# Altium project ANE_0002_01AA.PrjPCB (part 3 of 4)

## Sheet Boost_Converter.SchDoc
size A3; DocumentNumber: 8; SheetNumber: 8; SheetTotal: 11
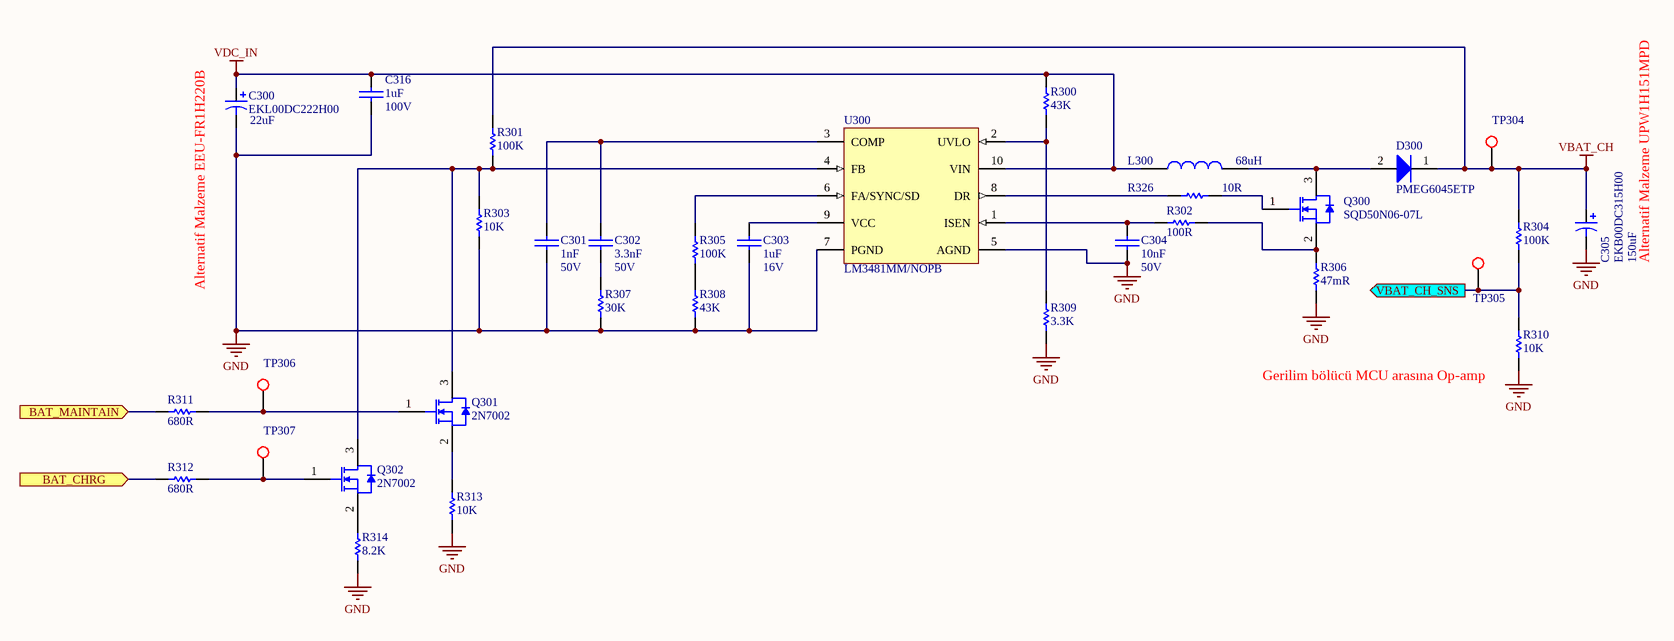
[diagram p7: Boost_Converter.SchDoc]

### Parts
C300  EKL00DC222H00  value 22uF  [CAPPR5-10X12.5]
C301  Operating Voltage: 50V  [CAPC1005X06N]  (hidden comment: 1nF)
C302  Operating Voltage: 50V  [CAPC1005X06N]  (hidden comment: 3.3nF)
C303  Operating Voltage: 16V  [CAPC2012X14N]  (hidden comment: 1uF)
C304  Operating Voltage: 50V  [CAPC1005X06N]  (hidden comment: 10nF)
C305  EKB00DC315H00  value 150uF  [CAPPR5-10X12.5]
C316  Operating Voltage: 100V  [CAPC3216X09N]  (hidden comment: 1uF)
D300  PMEG6045ETP  [DIOM3825X11N]
L300  68uH  [INDM120120X100N]
Q300  SQD50N06-07L  [TO228P970-3N]
Q301  2N7002  [SOT90P247X115-3N]
Q302  2N7002  [SOT90P247X115-3N]
R300  43K  [RESC1005X04N]
R301  100K  [RESC1005X04N]
R302  100R  [RESC1005X04N]
R303  10K  [RESC1005X04N]
R304  100K  [RESC1005X04N]
R305  100K  [RESC1005X04N]
R306  47mR  [RESC3216X08N]
R307  30K  [RESC1005X04N]
R308  43K  [RESC1005X04N]
R309  3.3K  [RESC1005X04N]
R310  10K  [RESC1005X04N]
R311  680R  [RESC1005X04N]
R312  680R  [RESC1005X04N]
R313  10K  [RESC1005X04N]
R314  8.2K  [RESC1005X04N]
R326  10R  [RESC1005X04N]
TP304  AEMT-C00S-1000-0000  [TP100]  (value not drawn)
TP305  AEMT-C00S-1000-0000  [TP100]  (value not drawn)
TP306  AEMT-C00S-1000-0000  [TP100]  (value not drawn)
TP307  AEMT-C00S-1000-0000  [TP100]  (value not drawn)
U300  LM3481MM/NOPB  [MUB10A_N]

### Ports
BAT_CHRG (in), BAT_MAINTAIN (in), VBAT_CH_SNS (out)

### Nets
GND: C300.2 C301.1 C303.1 C304.1 C305.2 C316.1 R303.1 R306.2 R307.1 R308.1 R309.1 R310.1 R313.1 R314.1 U300.5(AGND) U300.7(PGND)
VBAT_CH: C305.1 D300.1(K) R301.2 R304.2 TP304.1
VDC_IN: C300.1 C316.2 L300.1 R300.2 U300.10(VIN)
BAT_CHRG: R312.2 ; port BAT_CHRG
BAT_MAINTAIN: R311.2 ; port BAT_MAINTAIN
VBAT_CH_SNS: R304.1 R310.2 TP305.1 ; port VBAT_CH_SNS
NetC301_2: C301.2 C302.2 U300.3(COMP)
NetC302_1: C302.1 R307.2
NetC303_2: C303.2 U300.9(VCC)
NetC304_2: C304.2 R302.1 U300.1(ISEN)
NetD300_2: D300.2(A) L300.2 Q300.3(Drain)
NetQ300_1: Q300.1(Gate) R326.2
NetQ300_2: Q300.2(Source) R302.2 R306.1
NetQ301_1: Q301.1(Gate) R311.1 TP306.1
NetQ301_2: Q301.2(Source) R313.2
NetQ301_3: Q301.3(Drain) Q302.3(Drain) R301.1 R303.2 U300.4(FB)
NetQ302_1: Q302.1(Gate) R312.1 TP307.1
NetQ302_2: Q302.2(Source) R314.2
NetR300_1: R300.1 R309.2 U300.2(UVLO)
NetR305_1: R305.1 R308.2
NetR305_2: R305.2 U300.6(FA/SYNC/SD)
NetR326_1: R326.1 U300.8(DR)

### Notes on the sheet
- (near C300) Alternatif Malzeme EEU-FR1H220B
- (near C305) Alternatif Malzeme UPW1H151MPD
- (near R310) Gerilim bölücü MCU arasına Op-amp
- Title
- Size:
- Date:
- A3
- Number:
- Time:
- Revision:
- Sheet
- of
- File:

### Library data of the parts
C300 = EKL00DC222H00: Aluminum Electrolytic Capacitor, Radial Style with Long Leads: 22uF, 50V; Note: Refer to Manufacturer's Data Sheets for other lead formations; DrillSize: Nominal, Rounded To The Nearest 0.1mm; Published: 19-Mar-2004; DatasheetDocument: 12-Jan-2000; PackageReference: CAPPR5-10X12.5; Publisher: Altium Limited; ComponentLink1Description: Manufacturer Link; ComponentLink1URL: http://www.vishay.com/; ComponentLink2Description: Datasheet; ComponentLink2URL: http://www.vishay.com/docs/25010/ekl.pdf
C301 = ACC0-0100-S272-0000: CAP, CER, C0G, 1nF, %5, 50V, 0402; Manufacturer: Murata; Manufacturer Part Number: GRM1555C1H102JA01D; CR: 000049; Requested by: MU; Lead Finish: Pb Free; Material: Ceramic, C0G; Definition Date: 14.08.2012; Revision Date: *; Price: *; Supplier: *; Supplier Part Number: *; DS: 000049; Operating Temp: -55 to 125 C; Storage Temp: -55 to 125 C; Status: Active; Package Reference: EIA 0402, Metric 1005; Component Type: Capacitor; Footprint Type: SMD; Published by: MU; ESR: *; FR: *; Value: 1nF
C302 = ACC7-0330-S271-0000: CAP, CER, X7R, 3.3nF, %10, 50V, 0402; Manufacturer: Murata; Manufacturer Part Number: GRM155R71H332KA01D; CR: 000049; Requested by: MU; Lead Finish: Pb Free; Material: Ceramic, X7R; Definition Date: 14.08.2012; Revision Date: *; Price: *; Supplier: *; Supplier Part Number: *; DS: 000049; Operating Temp: -55 to 125 C; Storage Temp: -55 to 125 C; Status: Active; Package Reference: EIA 0402, Metric 1005; Component Type: Capacitor; Footprint Type: SMD; Published by: MU; ESR: *; FR: *; Value: 3.3nF
C303 = ACC7-3100-S441-0000: CAP, CER, X7R, 1uF, %10, 16V, 0805; Manufacturer: Murata; Manufacturer Part Number: GRM21BR71C105KA01L; CR: 000049; Requested by: MU; Lead Finish: Pb Free; Material: Ceramic, X7R; Definition Date: 14.08.2012; Revision Date: *; Price: *; Supplier: *; Supplier Part Number: *; DS: 000049; Operating Temp: -55 to 125 C; Storage Temp: -55 to 125 C; Status: Active; Package Reference: EIA 0805, Metric 2012; Component Type: Capacitor; Footprint Type: SMD; Published by: MU; ESR: *; FR: *; Value: 1uF
C304 = ACC7-1100-S271-0000: CAP, CER, X7R, 10nF, %10, 50V, 0402; Manufacturer: Murata; Manufacturer Part Number: GRM155R71H103KA88D; CR: 000049; Requested by: MU; Lead Finish: Pb Free; Material: Ceramic, X7R; Definition Date: 14.08.2012; Revision Date: *; Price: *; Supplier: *; Supplier Part Number: *; DS: 000049; Operating Temp: -55 to 125 C; Storage Temp: -55 to 125 C; Status: Active; Package Reference: EIA 0402, Metric 1005; Component Type: Capacitor; Footprint Type: SMD; Published by: MU; ESR: *; FR: *; Value: 10nF
C305 = EKB00DC315H00: Aluminum Electrolytic Capacitor, Radial Style with Long Leads: 150uF, 50V; Note: Refer to Manufacturer's Data Sheets for other lead formations; DrillSize: Nominal, Rounded To The Nearest 0.1mm; Published: 19-Mar-2004; DatasheetDocument: 21-Feb-2001; PackageReference: CAPPR5-10X12.5; Publisher: Altium Limited; ComponentLink1Description: Manufacturer Link; ComponentLink1URL: http://www.vishay.com/; ComponentLink2Description: Datasheet; ComponentLink2URL: http://www.vishay.com/docs/25013/ekb.pdf
C316 = ACC7-3100-S691-0000: CAP, CER, X7R, 1uF, %10, 100V, 1206; Manufacturer: Murata; Manufacturer Part Number: GRM31CR72A105KA01L; CR: 344; Requested by: NK; DS: 00049; Lead Finish: Pb Free; Published by: IS; Material: Ceramic, X7R; Definition Date: 13.02.2014; Revision Date: *; Price: *; Supplier: *; Supplier Part Number: *; Operating Temp: -55 to 125 C; Storage Temp: -55 to 125 C; Status: Active; Package Reference: EIA 1206, Metric 3216; Component Type: Capacitor; Footprint Type: SMD; ESR: *; FR: *; Value: 1uF
D300 = AS15-945M-SI10-0000: Diode, Schottky, 0.53V @4.5A, 60V, SOD-128; Manufacturer: NXP; Lead Finish: Pb Free; Published by: NK; Price: *; Manufacturer Part Number: PMEG6045ETP; CR: -; DS: -; Definition Date: 25.07.2015; Footprint Type: SMD; JEDEC Code: *; Operating Temp: -55 to 175 C; Package Reference: SOD128; Requested by: NK; Revision Date: *; Status: Active; Storage Temp: -65to 175 C; Supplier: *; Supplier Part Number: *; Component Type: DIODE; Forward Voltage: *; Reverse Voltage: *; Value: *
L300 = AL17-1680-SN35-3300: Inductor, Power, 68uH, 3A, 0.1ohm, SMD; Manufacturer: Bourns; Manufacturer Part Number: SRR1210-680M; DCR(max): 0.102; Published By: NK; CR: -; DS: -; Component Type: Power Inductor; Definition Date: 26.07.2015; Footprint Type: SMD; Height: 10; Operating Temp: -40, +125; Rated Current: 3A; Requested By: NK; Value: 68uH
Q300 = AS26-A50M-SI40-0000: Transistor, MOSFET, N, 60V, 50A, 7.6mR, SQD50N06-07L, TO-252; Manufacturer Part Number: SQD50N06-07L-GE3; Manufacturer: VISHAY; CR: 000207/85; DS: 000207; Lead Finish: Pb Free; Published by: MU; Requested by: MAY; Vgs(max): +-20V; Price: *; Definition Date: 18.02.2013; Footprint Type: SMD; JEDEC Code: TO-252; Operating Temp: -55 to 175 C; Package Reference: TO-252; Revision Date: *; Status: Active; Storage Temp: -55 to 175 C; Supplier: *; Supplier Part Number: *; Component Type: TRS/MOSFET; Vds(max): 60V; Id: 50A; Value: SQD50N06-07L
Q301 Q302 = AS26-810M-SI20-0000: Transistor, MOSFET, N, 60V, 115mA, 2N7002, SOT23; Manufacturer: Fairchild; CR: 000338; DS: 000368; JEDEC Code: TO-236AB; Lead Finish: Pb Free; Published by: MU; Requested by: MAY; Vgs(max): +-20V; Price: *; Manufacturer Part Number: 2N7002; Definition Date: 27.01.2014; Footprint Type: SMD; Operating Temp: -55 to 150 C; Package Reference: SOT23; Revision Date: *; Status: Active; Storage Temp: -55 to 150 C; Supplier: *; Supplier Part Number: *; Component Type: TRS/MOSFET; Vds(max): 60V; Id: 115mA; Value: 2N7002
R300 R308 = AR19-4430-S2B2-0000: RES, E24, Thick Film, SMD, 43K, 1%, 0.1W, 0402; Manufacturer: Panasonic; Manufacturer Part Number: ERJ-2RKF4302X; CR: DS00073; Requested by: MU; Lead Finish: Pb Free; Max. Operating Voltage: 50V; Definition Date: 16.08.2012; Revision Date: *; Price: *; Supplier: *; Supplier Part Number: *; DS: DS00073; Operating Temp: -55 to 155 C; Storage Temp: -55 to 155 C; Status: Active; Package Reference: EIA 0402, Metric 1005; Component Type: Resistor; Footprint Type: SMD; Published by: MU; JEDEC Code: *; Material: Thick Film; ESR: *; FR: *; Power Rating: 0.1W; Value: 43K
R301 R304 R305 = AR19-5100-S2B2-0000: RES, E24, Thick Film, SMD, 100K, 1%, 0.1W, 0402; Manufacturer: Panasonic; Manufacturer Part Number: ERJ-2RKF1003X; CR: DS00073; Requested by: MU; Lead Finish: Pb Free; Max. Operating Voltage: 50V; Definition Date: 16.08.2012; Revision Date: *; Price: *; Supplier: *; Supplier Part Number: *; DS: DS00073; Operating Temp: -55 to 155 C; Storage Temp: -55 to 155 C; Status: Active; Package Reference: EIA 0402, Metric 1005; Component Type: Resistor; Footprint Type: SMD; Published by: MU; JEDEC Code: *; Material: Thick Film; ESR: *; FR: *; Power Rating: 0.1W; Value: 100K
R302 = AR19-2100-S2B2-0000: RES, E24, Thick Film, SMD, 100R, 1%, 0.1W, 0402; Manufacturer: Panasonic; Manufacturer Part Number: ERJ-2RKF1000X; CR: DS00073; Requested by: MU; Lead Finish: Pb Free; Max. Operating Voltage: 50V; Definition Date: 16.08.2012; Revision Date: *; Price: *; Supplier: *; Supplier Part Number: *; DS: DS00073; Operating Temp: -55 to 155 C; Storage Temp: -55 to 155 C; Status: Active; Package Reference: EIA 0402, Metric 1005; Component Type: Resistor; Footprint Type: SMD; Published by: MU; JEDEC Code: *; Material: Thick Film; ESR: *; FR: *; Power Rating: 0.1W; Value: 100R
R303 R310 R313 = AR19-4100-S2B2-0000: RES, E24, Thick Film, SMD, 10K, 1%, 0.1W, 0402; Manufacturer: Panasonic; Manufacturer Part Number: ERJ-2RKF1002X; CR: DS00073; Requested by: MU; Lead Finish: Pb Free; Max. Operating Voltage: 50V; Definition Date: 16.08.2012; Revision Date: *; Price: *; Supplier: *; Supplier Part Number: *; DS: DS00073; Operating Temp: -55 to 155 C; Storage Temp: -55 to 155 C; Status: Active; Package Reference: EIA 0402, Metric 1005; Component Type: Resistor; Footprint Type: SMD; Published by: MU; JEDEC Code: *; Material: Thick Film; ESR: *; FR: *; Power Rating: 0.1W; Value: 10K
R306 = AR19-Y470-S5D2-0000: RES, Thick Film, SMD, 47mR, 1%, 1W, 1206; Manufacturer: Panasonic; Manufacturer Part Number: ERJ-8BWFR047V; CR: 000078/95; Requested by: MU; DS: 000078; Lead Finish: Pb Free; Max. Operating Voltage: 0.40; Definition Date: 19.02.2013; Revision Date: *; Price: *; Supplier: *; Supplier Part Number: *; Operating Temp: -55 to 155 C; Storage Temp: -55 to 155 C; Status: Active; Package Reference: EIA 1206, Metric 3216; Component Type: Resistor; Footprint Type: SMD; Published by: MU; JEDEC Code: *; Material: Thick Film; ESR: *; FR: *; Power Rating: 1W; Value: 47mR
R307 = AR19-4300-S2B2-0000: RES, E24, Thick Film, SMD, 30K, 1%, 0.1W, 0402; Manufacturer: Panasonic; Manufacturer Part Number: ERJ-2RKF3002X; CR: DS00073; Requested by: MU; Lead Finish: Pb Free; Max. Operating Voltage: 50V; Definition Date: 16.08.2012; Revision Date: *; Price: *; Supplier: *; Supplier Part Number: *; DS: DS00073; Operating Temp: -55 to 155 C; Storage Temp: -55 to 155 C; Status: Active; Package Reference: EIA 0402, Metric 1005; Component Type: Resistor; Footprint Type: SMD; Published by: MU; JEDEC Code: *; Material: Thick Film; ESR: *; FR: *; Power Rating: 0.1W; Value: 30K
R309 = AR19-3330-S2B2-0000: RES, E24, Thick Film, SMD, 3.3K, 1%, 0.1W, 0402; Manufacturer: Panasonic; Manufacturer Part Number: ERJ-2RKF3301X; CR: DS00073; Requested by: MU; Lead Finish: Pb Free; Max. Operating Voltage: 50V; Definition Date: 16.08.2012; Revision Date: *; Price: *; Supplier: *; Supplier Part Number: *; DS: DS00073; Operating Temp: -55 to 155 C; Storage Temp: -55 to 155 C; Status: Active; Package Reference: EIA 0402, Metric 1005; Component Type: Resistor; Footprint Type: SMD; Published by: MU; JEDEC Code: *; Material: Thick Film; ESR: *; FR: *; Power Rating: 0.1W; Value: 3.3K
R311 R312 = AR19-2680-S2B2-0000: RES, E24, Thick Film, SMD, 680R, 1%, 0.1W, 0402; Manufacturer: Panasonic; Manufacturer Part Number: ERJ-2RKF6800X; CR: DS00073; Requested by: MU; Lead Finish: Pb Free; Max. Operating Voltage: 50V; Definition Date: 16.08.2012; Revision Date: *; Price: *; Supplier: *; Supplier Part Number: *; DS: DS00073; Operating Temp: -55 to 155 C; Storage Temp: -55 to 155 C; Status: Active; Package Reference: EIA 0402, Metric 1005; Component Type: Resistor; Footprint Type: SMD; Published by: MU; JEDEC Code: *; Material: Thick Film; ESR: *; FR: *; Power Rating: 0.1W; Value: 680R
R314 = AR19-3820-S2B2-0000: RES, E24, Thick Film, SMD, 8.2K, 1%, 0.1W, 0402; Manufacturer: Panasonic; Manufacturer Part Number: ERJ-2RKF8201X; CR: DS00073; Requested by: MU; Lead Finish: Pb Free; Max. Operating Voltage: 50V; Definition Date: 16.08.2012; Revision Date: *; Price: *; Supplier: *; Supplier Part Number: *; DS: DS00073; Operating Temp: -55 to 155 C; Storage Temp: -55 to 155 C; Status: Active; Package Reference: EIA 0402, Metric 1005; Component Type: Resistor; Footprint Type: SMD; Published by: MU; JEDEC Code: *; Material: Thick Film; ESR: *; FR: *; Power Rating: 0.1W; Value: 8.2K
R326 = AR19-1100-S2B2-0000: RES, E24, Thick Film, SMD, 10R, 1%, 0.1W, 0402; Manufacturer: Panasonic; Manufacturer Part Number: ERJ-2RKF10R0X; CR: DS00073; Requested by: MU; Lead Finish: Pb Free; Max. Operating Voltage: 50V; Definition Date: 16.08.2012; Revision Date: *; Price: *; Supplier: *; Supplier Part Number: *; DS: DS00073; Operating Temp: -55 to 155 C; Storage Temp: -55 to 155 C; Status: Active; Package Reference: EIA 0402, Metric 1005; Component Type: Resistor; Footprint Type: SMD; Published by: MU; JEDEC Code: *; Material: Thick Film; ESR: *; FR: *; Power Rating: 0.1W; Value: 10R
TP304-TP307 = AEMT-C00S-1000-0000: Test Point, Circular, 1mm; Text: TEST_POINT
U300 = LM3481MM/NOPB: High Efficiency Low-Side N-Channel Controller for Switching Regulators, 10-pin MSOP, Pb-Free; Manufacturer: National Semiconductor; PackageTopMarking: ZXTT*SJPB; PowerWise: N; CompType: MiscPower; High-Reliability: Y; DatasheetVersion: Mar-2011; PackageVersion: revB, Jul-2003; PackageReference: MUB10A; PackageDescription: Mini-SO, Molded, .118 x .118 x .034in Body, 10 Lead, .0197in Pitch; PartNumber: LM3481MM/NOPB; RoHS: Y; PinCount: 10; Code_JEDEC: MO-187-BA; ComponentLink1Description: Manufacturer URL; ComponentLink1URL: http://www.national.com/; ComponentLink2Description: LM3481 Datasheet; ComponentLink2URL: http://www.national.com/ds/LM/LM3481.pdf; ComponentLink3Description: LM3481 Web Page; ComponentLink3URL: http://www.national.com/pf/LM/LM3481.html; ComponentLink4Description: MUB10A Package Page; ComponentLink4URL: http://www.national.com/packaging/folders/mub10a.html

## Sheet Buck_Converter.SchDoc
size A3; DocumentNumber: 10; SheetNumber: 10; SheetTotal: 11
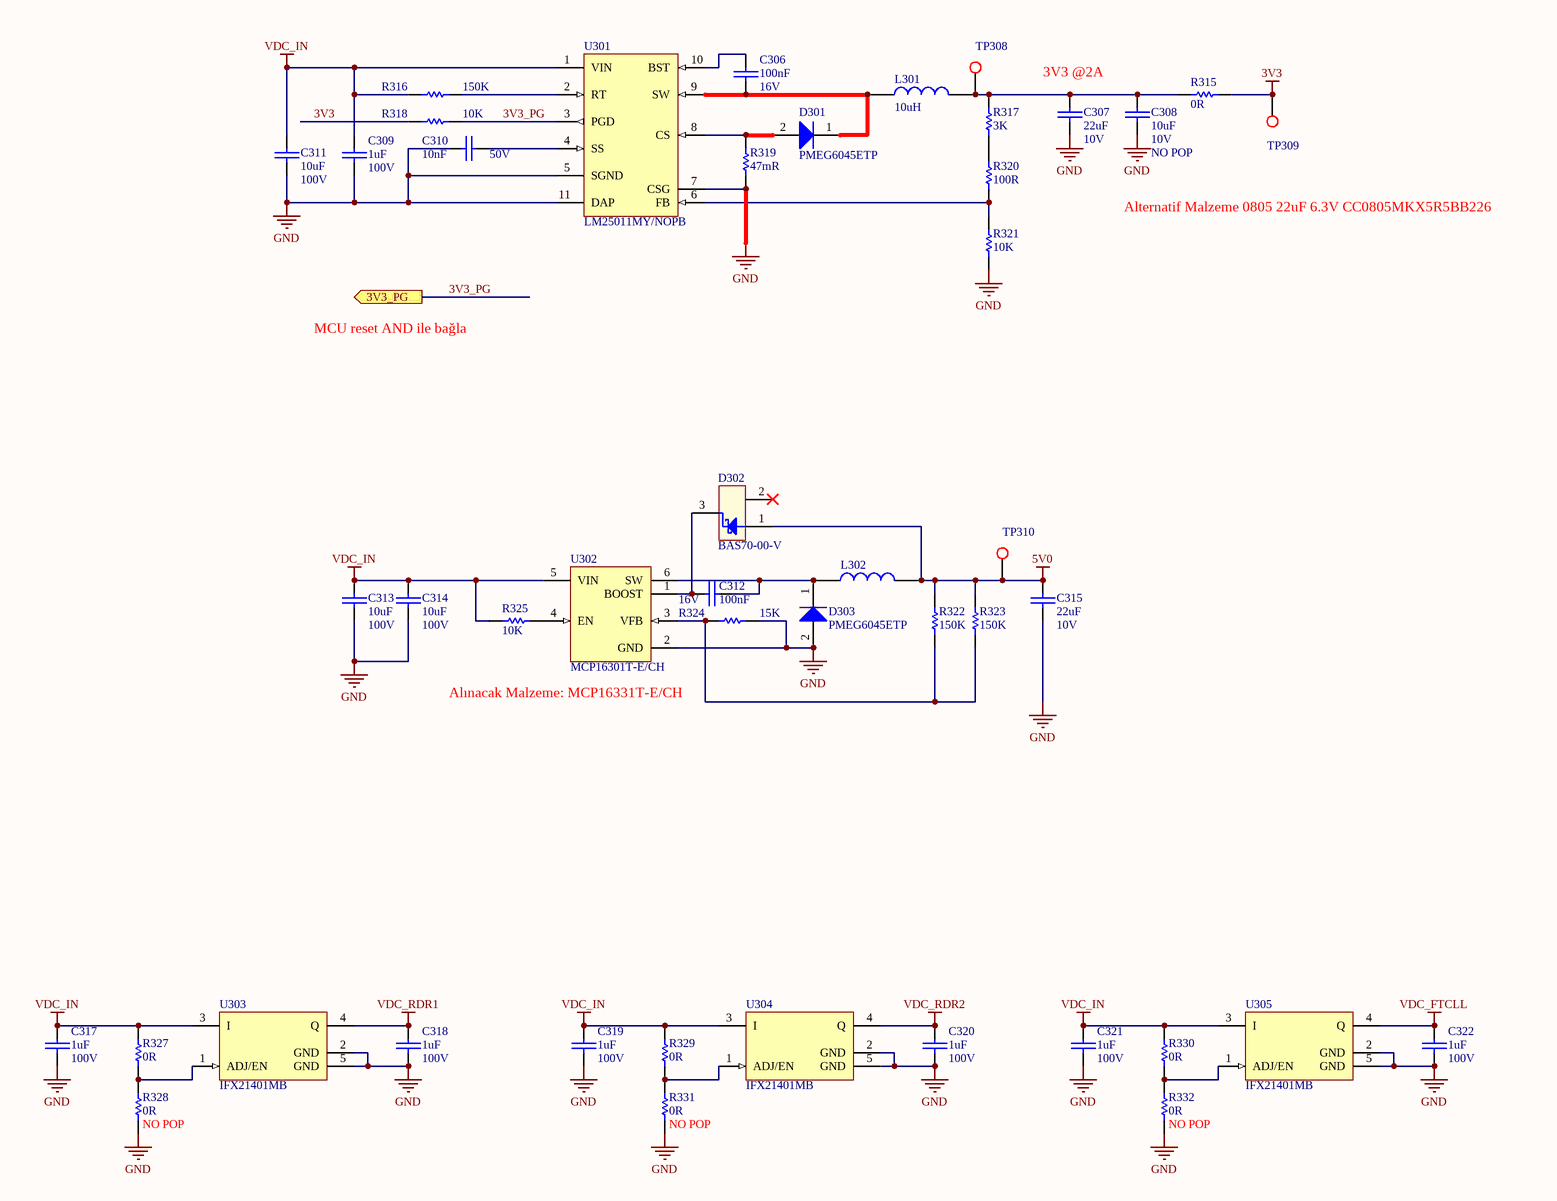
[diagram p8: Buck_Converter.SchDoc]

### Parts
C306  Operating Voltage: 16V  [CAPC1005X06N]  (hidden comment: 100nF)
C307  Operating Voltage: 10V  [CAPC3225X27N]  (hidden comment: 22uF)
C308  Operating Voltage: 10V  Assembly: NO POP  [CAPC2012X09N]  (hidden comment: 10uF)
C309  Operating Voltage: 100V  [CAPC3216X09N]  (hidden comment: 1uF)
C310  Operating Voltage: 50V  [CAPC1005X06N]  (hidden comment: 10nF)
C311  Operating Voltage: 100V  [CAPC5750X25N]  (hidden comment: 10uF)
C312  Operating Voltage: 16V  [CAPC1005X06N]  (hidden comment: 100nF)
C313  Operating Voltage: 100V  [CAPC5750X25N]  (hidden comment: 10uF)
C314  Operating Voltage: 100V  [CAPC5750X25N]  (hidden comment: 10uF)
C315  Operating Voltage: 10V  [CAPC3225X27N]  (hidden comment: 22uF)
C317  Operating Voltage: 100V  [CAPC3216X09N]  (hidden comment: 1uF)
C318  Operating Voltage: 100V  [CAPC3216X09N]  (hidden comment: 1uF)
C319  Operating Voltage: 100V  [CAPC3216X09N]  (hidden comment: 1uF)
C320  Operating Voltage: 100V  [CAPC3216X09N]  (hidden comment: 1uF)
C321  Operating Voltage: 100V  [CAPC3216X09N]  (hidden comment: 1uF)
C322  Operating Voltage: 100V  [CAPC3216X09N]  (hidden comment: 1uF)
D301  PMEG6045ETP  [DIOM3825X11N]
D302  BAS70-00-V  [SOT90P247X115-3N]
D303  PMEG6045ETP  [DIOM3825X11N]
L301  10uH  [INDM125125X65N]
L302  (no value)  [INDM125125X65N]
R315  0R  [RESC2012X07N]
R316  150K  [RESC1005X04N]
R317  3K  [RESC1005X04N]
R318  10K  [RESC1005X04N]
R319  47mR  [RESC3216X08N]
R320  100R  [RESC1005X04N]
R321  10K  [RESC1005X04N]
R322  150K  [RESC1005X04N]
R323  150K  [RESC1005X04N]
R324  15K  [RESC1005X04N]
R325  10K  [RESC1005X04N]
R327  0R  [RESC1005X04N]
R328  Assembly: NO POP  [RESC1005X04N]  (hidden comment: 0R)
R329  0R  [RESC1005X04N]
R330  0R  [RESC1005X04N]
R331  Assembly: NO POP  [RESC1005X04N]  (hidden comment: 0R)
R332  Assembly: NO POP  [RESC1005X04N]  (hidden comment: 0R)
TP308  AEMT-C00S-1000-0000  [TP100]  (value not drawn)
TP309  AEMT-C00S-1000-0000  [TP100]  (value not drawn)
TP310  AEMT-C00S-1000-0000  [TP100]  (value not drawn)
U301  LM25011MY/NOPB  [MUC10A_N]
U302  MCP16301T-E/CH  [MCHP-SOT-23-CH6_N]
U303  IFX21401MB  [INF-PG-SCT595_V]
U304  IFX21401MB  [INF-PG-SCT595_V]
U305  IFX21401MB  [INF-PG-SCT595_V]

### Ports
3V3_PG (out)

### Nets
3V3: R315.2 R318.2 TP309.1
5V0: C315.2 D302.1 L302.2 R322.2 R323.2 TP310.1
GND: C307.1 C308.1 C309.1 C310.1 C311.1 C313.1 C314.1 C315.1 C317.1 C318.1 C319.1 C320.1 C321.1 C322.1 D303.2(A) R319.2 R321.1 R324.1 R328.1 R331.1 R332.1 U301.5(SGND) U301.7(CSG) U301.11(DAP) U302.2(GND) U303.2(GND) U303.5(GND) U304.2(GND) U304.5(GND) U305.2(GND) U305.5(GND)
VDC_FTCLL: C322.2 U305.4(Q)
VDC_IN: C309.2 C311.2 C313.2 C314.2 C317.2 C319.2 C321.2 R316.2 R325.1 R327.2 R329.2 R330.2 U301.1(VIN) U302.5(VIN) U303.3(I) U304.3(I) U305.3(I)
VDC_RDR1: C318.2 U303.4(Q)
VDC_RDR2: C320.2 U304.4(Q)
3V3_PG: R318.1 U301.3(PGD) ; port 3V3_PG
NetC306_1: C306.1 D301.1(K) L301.1 U301.9(SW)
NetC306_2: C306.2 U301.10(BST)
NetC307_2: C307.2 C308.2 L301.2 R315.1 R317.2 TP308.1
NetC310_2: C310.2 U301.4(SS)
NetC312_1: C312.1 D303.1(K) L302.1 U302.6(SW)
NetC312_2: C312.2 D302.3 U302.1(BOOST)
NetD301_2: D301.2(A) R319.1 U301.8(CS)
NetR316_1: R316.1 U301.2(RT)
NetR317_1: R317.1 R320.1
NetR320_2: R320.2 R321.2 U301.6(FB)
NetR322_1: R322.1 R323.1 R324.2 U302.3(VFB)
NetR325_2: R325.2 U302.4(EN)
NetR327_1: R327.1 R328.2 U303.1(ADJ/EN)
NetR329_1: R329.1 R331.2 U304.1(ADJ/EN)
NetR330_1: R330.1 R332.2 U305.1(ADJ/EN)

Not connected (* = marked no-connect by the designer): D302 2(NC)*

### Notes on the sheet
- (near C307) 3V3 @2A
- Alternatif Malzeme 0805 22uF 6.3V CC0805MKX5R5BB226
- MCU reset AND ile bağla
- (near U302) Alınacak Malzeme: MCP16331T-E/CH
- Title
- Size:
- Date:
- A3
- Number:
- Time:
- Revision:
- Sheet
- of
- File:

### Library data of the parts
C306 C312 = ACC7-2100-S241-0000: CAP, CER, X7R, 100nF, %10, 16V, 0402; Manufacturer: Murata; Manufacturer Part Number: GRM155R71C104KA88D; CR: 000049; Requested by: MU; Lead Finish: Pb Free; Material: Ceramic, X7R; Definition Date: 14.08.2012; Revision Date: *; Price: *; Supplier: *; Supplier Part Number: *; DS: 000049; Operating Temp: -55 to 125 C; Storage Temp: -55 to 125 C; Status: Active; Package Reference: EIA 0402, Metric 1005; Component Type: Capacitor; Footprint Type: SMD; Published by: MU; ESR: *; FR: *; Value: 100nF
C307 C315 = ACC7-4220-S730-0000: CAP, CER, X7R, 22uF, %20, 10V, 1210; Manufacturer: Murata; Manufacturer Part Number: GRM32ER71A226KE20L; CR: 000131; Requested by: OO; Lead Finish: Pb Free; Published by: MU; Material: Ceramic, X7R; Definition Date: 31.10.2012; Revision Date: 09.07.2013; Price: *; Supplier: *; Supplier Part Number: *; DS: 000131; Operating Temp: -55 to 125 C; Storage Temp: -55 to 125 C; Status: Active; Package Reference: EIA 1210, Metric 3225; Component Type: Capacitor; Footprint Type: SMD; JEDEC Code: *; ESR: *; FR: *; Value: 22uF
C308 = ACC7-4100-S431-0000: CAP, CER, X7R, 10uF, %10, 10V, 0805; Manufacturer: Murata; Manufacturer Part Number: GRM21BR71A106KE51L; CR: 000049; Requested by: MAY; Lead Finish: Pb Free; Published by: MU; Material: Ceramic, X7R; Definition Date: 22.10.2012; Revision Date: *; Price: *; Supplier: *; Supplier Part Number: *; DS: 000049; Operating Temp: -55 to 125 C; Storage Temp: -55 to 125 C; Status: Active; Package Reference: EIA 0805, Metric 2012; Component Type: Capacitor; Footprint Type: SMD; ESR: *; FR: *; Value: 10uF
C309 C317-C322 = ACC7-3100-S691-0000: as C316 on sheet Boost_Converter; Definition Date: 13.02.2014; Revision Date: *; Price: *; Supplier: *; Supplier Part Number: *; Operating Temp: -55 to 125 C; Storage Temp: -55 to 125 C; Status: Active; Package Reference: EIA 1206, Metric 3216; Component Type: Capacitor; Footprint Type: SMD; ESR: *; FR: *; Value: 1uF
C310 = ACC7-1100-S271-0000: as C304 on sheet Boost_Converter; Definition Date: 14.08.2012; Revision Date: *; Price: *; Supplier: *; Supplier Part Number: *; DS: 000049; Operating Temp: -55 to 125 C; Storage Temp: -55 to 125 C; Status: Active; Package Reference: EIA 0402, Metric 1005; Component Type: Capacitor; Footprint Type: SMD; Published by: MU; ESR: *; FR: *; Value: 10nF
C311 C313 C314 = ACC4-4100-SD91-0000: CAP, CER, X7S, 10uF, %10, 100V, 2220; Manufacturer: TDK; Manufacturer Part Number: CGA9N3X7S2A106K230KB; CR: 232; Requested by: MU; DS: 000310; Lead Finish: Pb Free; Material: Ceramic, X7S; Definition Date: 23.08.2013; Revision Date: *; Price: *; Supplier: *; Supplier Part Number: *; Operating Temp: -55 to 125 C; Storage Temp: -55 to 125 C; Status: Active; Package Reference: EIA 5750, Metric 2220; Component Type: Capacitor; Footprint Type: SMD; Published by: MU; FR: *; Value: 10uF
D301 D303 = AS15-945M-SI10-0000: as D300 on sheet Boost_Converter; Price: *; Manufacturer Part Number: PMEG6045ETP; CR: -; DS: -; Definition Date: 25.07.2015; Footprint Type: SMD; JEDEC Code: *; Operating Temp: -55 to 175 C; Package Reference: SOD128; Requested by: NK; Revision Date: *; Status: Active; Storage Temp: -65to 175 C; Supplier: *; Supplier Part Number: *; Component Type: DIODE; Forward Voltage: *; Reverse Voltage: *; Value: *
D302 = AS15-820M-SI20-0002: Diode, Schottky, 0.41V @1mA, BAS70-00-V, SOT23; Manufacturer: VISHAY; CR: 000193/78; DS: 000193; Lead Finish: Pb Free; Published by: MU; Requested by: OO; Reverse Voltage: 70V; Price: *; Manufacturer Part Number: BAS70-00-V; Definition Date: 07.02.2013; Footprint Type: SMD; JEDEC Code: *; Operating Temp: -65 to 125 C; Package Reference: SOT23; Revision Date: 16.02.2013; Status: Active; Storage Temp: -65 to 150 C; Supplier: *; Supplier Part Number: *; Component Type: DIODE; Forward Voltage: 0.41V @1mA; Value: BAS70-00-V
L301 = AL17-1000-SN35-3550: Inductor, Power, 10uH, 5.5A, 20mohm, SMD; Manufacturer: Bourns; Manufacturer Part Number: SRR1260-100M; Published By: NK; Component Type: Power Inductor; Definition Date: 25.07.2015; Footprint Type: SMD; Operating Temp: -40, +125; Rated Current: 5.5A; Requested By: NK; Value: 10uH
L302 = AL17-2200-SN35-3400: Inductor, Power, 22uH, 4A, 43 mohm, SMD; Manufacturer: Bourns; Manufacturer Part Number: SRR1260-220M; Published By: NK; Component Type: Power Inductor; Definition Date: 25.07.2015; Footprint Type: SMD; Operating Temp: -40, +125; Rated Current: 4A; Requested By: NK
R315 = AR19-0000-S407-0000: RES, Thick Film, SMD, 0R, Jumper, 0.125W, 0805; Manufacturer: Panasonic; Manufacturer Part Number: ERJ-6GEY0R00V; CR: 000062; Requested by: MAY; Lead Finish: Pb Free; Published by: MU; Max. Operating Voltage: 150V; Definition Date: 09.11.2012; Revision Date: *; Price: *; Supplier: *; Supplier Part Number: *; DS: 000062; Operating Temp: -55 to 155 C; Storage Temp: -55 to 155 C; Status: Active; Package Reference: EIA 0805, Metric 2012; Component Type: Resistor; Footprint Type: SMD; JEDEC Code: *; Material: Thick Film; ESR: *; FR: *; Power Rating: 0.125W; Value: 0R
R316 R322 R323 = AR19-5150-S2B2-0000: RES, E24, Thick Film, SMD, 150K, 1%, 0.1W, 0402; Manufacturer: Panasonic; Manufacturer Part Number: ERJ-2RKF1503X; CR: DS00073; Requested by: MU; Lead Finish: Pb Free; Max. Operating Voltage: 50V; Definition Date: 16.08.2012; Revision Date: *; Price: *; Supplier: *; Supplier Part Number: *; DS: DS00073; Operating Temp: -55 to 155 C; Storage Temp: -55 to 155 C; Status: Active; Package Reference: EIA 0402, Metric 1005; Component Type: Resistor; Footprint Type: SMD; Published by: MU; JEDEC Code: *; Material: Thick Film; ESR: *; FR: *; Power Rating: 0.1W; Value: 150K
R317 = AR19-3300-S2B2-0000: RES, E24, Thick Film, SMD, 3K, 1%, 0.1W, 0402; Manufacturer: Panasonic; Manufacturer Part Number: ERJ-2RKF3001X; CR: DS00073; Requested by: MU; Lead Finish: Pb Free; Max. Operating Voltage: 50V; Definition Date: 16.08.2012; Revision Date: *; Price: *; Supplier: *; Supplier Part Number: *; DS: DS00073; Operating Temp: -55 to 155 C; Storage Temp: -55 to 155 C; Status: Active; Package Reference: EIA 0402, Metric 1005; Component Type: Resistor; Footprint Type: SMD; Published by: MU; JEDEC Code: *; Material: Thick Film; ESR: *; FR: *; Power Rating: 0.1W; Value: 3K
R318 R321 R325 = AR19-4100-S2B2-0000: as R303 on sheet Boost_Converter; Definition Date: 16.08.2012; Revision Date: *; Price: *; Supplier: *; Supplier Part Number: *; DS: DS00073; Operating Temp: -55 to 155 C; Storage Temp: -55 to 155 C; Status: Active; Package Reference: EIA 0402, Metric 1005; Component Type: Resistor; Footprint Type: SMD; Published by: MU; JEDEC Code: *; Material: Thick Film; ESR: *; FR: *; Power Rating: 0.1W; Value: 10K
R319 = AR19-Y470-S5D2-0000: as R306 on sheet Boost_Converter; Definition Date: 19.02.2013; Revision Date: *; Price: *; Supplier: *; Supplier Part Number: *; Operating Temp: -55 to 155 C; Storage Temp: -55 to 155 C; Status: Active; Package Reference: EIA 1206, Metric 3216; Component Type: Resistor; Footprint Type: SMD; Published by: MU; JEDEC Code: *; Material: Thick Film; ESR: *; FR: *; Power Rating: 1W; Value: 47mR
R320 = AR19-2100-S2B2-0000: as R302 on sheet Boost_Converter; Definition Date: 16.08.2012; Revision Date: *; Price: *; Supplier: *; Supplier Part Number: *; DS: DS00073; Operating Temp: -55 to 155 C; Storage Temp: -55 to 155 C; Status: Active; Package Reference: EIA 0402, Metric 1005; Component Type: Resistor; Footprint Type: SMD; Published by: MU; JEDEC Code: *; Material: Thick Film; ESR: *; FR: *; Power Rating: 0.1W; Value: 100R
R324 = AR19-4150-S2B2-0000: RES, E24, Thick Film, SMD, 15K, 1%, 0.1W, 0402; Manufacturer: Panasonic; Manufacturer Part Number: ERJ-2RKF1502X; CR: DS00073; Requested by: MU; Lead Finish: Pb Free; Max. Operating Voltage: 50V; Definition Date: 16.08.2012; Revision Date: *; Price: *; Supplier: *; Supplier Part Number: *; DS: DS00073; Operating Temp: -55 to 155 C; Storage Temp: -55 to 155 C; Status: Active; Package Reference: EIA 0402, Metric 1005; Component Type: Resistor; Footprint Type: SMD; Published by: MU; JEDEC Code: *; Material: Thick Film; ESR: *; FR: *; Power Rating: 0.1W; Value: 15K
R327-R332 = AR19-0000-S201-0000: RES, Thick Film, SMD, 0R, Jumper, 0.1W, 0402; Manufacturer: Panasonic; Manufacturer Part Number: ERJ-2GE0R00X; CR: 000062; Requested by: MAY; Lead Finish: Pb Free; Published by: MU; Max. Operating Voltage: 50V; Definition Date: 09.07.2012; Revision Date: *; Price: *; Supplier: *; Supplier Part Number: *; DS: 000062; Operating Temp: -55 to 155 C; Storage Temp: -55 to 155 C; Status: Active; Package Reference: EIA 0402, Metric 1005; Component Type: Resistor; Footprint Type: SMD; JEDEC Code: *; Material: Thick Film; ESR: *; FR: *; Power Rating: 0.1W; Value: 0R
TP308-TP310 = AEMT-C00S-1000-0000: as TP304 on sheet Boost_Converter
U301 = LM25011MY/NOPB: 42V, 2A Constant On-Time Switching Regulator with Adjustable Current Limit, 10-pin eMSOP, Pb-Free; Manufacturer: National Semiconductor; PackageTopMarking: ZXTT*SVUB; PowerWise: N; CompType: Switcher; High-Reliability: Y; DatasheetVersion: Jan-2011; PackageVersion: revA, May-2006; PackageReference: MUC10A; PackageDescription: Molded Mini-SO, Exposed Pad .118 x .118 x .034in Body, 10 Lead, .0197in Pitch; PartNumber: LM25011MY/NOPB; RoHS: Y; PinCount: 10; Code_JEDEC: MO-187-BAT; ComponentLink1Description: Manufacturer URL; ComponentLink1URL: http://www.national.com/; ComponentLink2Description: LM25011 Datasheet; ComponentLink2URL: http://www.national.com/ds/LM/LM25011.pdf; ComponentLink3Description: LM25011 Web Page; ComponentLink3URL: http://www.national.com/pf/LM/LM25011.html; ComponentLink4Description: MUC10A Package Page; ComponentLink4URL: http://www.national.com/packaging/folders/muc10a.html
U302 = MCP16301T-E/CH: High-Voltage Input Integrated Switch Step-Down Regulator, 600 mA, Input Voltage 4.0 to 30 V, Output Voltage 2.0 to 15 V, -40 to 125 degC, 6-pin SOT-23 (CH6), Tape and Reel; Manufacturer: Microchip; DatasheetVersion: Rev. B; PackageVersion: C04-028B; PackageReference: SOT-23-CH6; PackageDescription: 6-Lead Plastic Small Outline Transistor, 2.9 x 1.55 mm Body, 0.95 mm Pitch; Supplier 1: Digi-Key; Supplier Part Number 1: MCP16301T-E/CH-ND; Supplier 2: Newark; Supplier Part Number 2: 31W8729; Supplier 3: Mouser; Supplier Part Number 3: 579-MCP16301T-E/CH; Mounting Technology: Surface Mount; PartNumber: MCP16301T-E/CH; ComponentLink1Description: Manufacturer URL; ComponentLink1URL: http://www.microchip.com; ComponentLink2Description: Datasheet; ComponentLink2URL: http://ww1.microchip.com/downloads/en/DeviceDoc/25004B.pdf; ComponentLink3Description: Package Specification; ComponentLink3URL: http://www.microchip.com/stellent/groups/techpub_sg/documents/packagingspec/en012702.pdf; ComponentLink4Description: Product URL; ComponentLink4URL: http://www.microchip.com/MCP16301
U303-U305 = IFX21401MB: Low Dropout Voltage Tracking Regulator, 4 to 45 V Operating, 50 mA, -40 to 125 degC, PG-SCT595, Reel, Green; Manufacturer: Infineon; Accuracy: 0.5 %; Automotive Qualified: FALSE; Dropout Voltage: 300 mV; Green: TRUE; Max Number Reflow: 3; Max Peak Reflow Temp: 260 degC; Max. Output Current: 50 mA; Output Voltage: adj.; Regulator Type: Linear->tracker; Typical Quiescent Current: 140 uA; DatasheetVersion: Rev. 1.01; PackageVersion: Apr-08; PackageReference: PG-SCT595; PackageDescription: 5-Pin Semiconductor Transistor Package, 2.9 x 1.6 mm Body, 0.95 mm Pitch; Supplier 1: Mouser; Supplier Part Number 1: 726-IFX21401MB; Supplier 2: Newark; Supplier Part Number 2: 47W3452; Supplier 3: Farnell; Supplier Part Number 3: 2215570; Supplier 4: Digi-Key; Supplier Part Number 4: IFX21401MBINTR-ND; Supplier 5: Digi-Key; Supplier Part Number 5: IFX21401MBINCT-ND; Supplier 6: Digi-Key; Supplier Part Number 6: IFX21401MBINDKR-ND; MSL: 1; Packing: Reel; Reset: FALSE; Status Output: FALSE; Mounting Technology: Surface Mount; PartNumber: IFX21401MB; ComponentLink1Description: Manufacturer URL; ComponentLink1URL: http://www.infineon.com/; ComponentLink2Description: Datasheet; ComponentLink2URL: http://www.infineon.com/dgdl/IFX21401_DS_101.pdf?folderId=db3a30431ff988150120802bce1d257a&fileId=db3a304320d39d590120f61daff769d0; ComponentLink3Description: Package Specification; ComponentLink3URL: http://www.infineon.com/dgdl/SCT595-Package_Overview.pdf?folderId=db3a30431936bc4b01195289a4e23b8a&fileId=db3a30431936bc4b0119529a880d3bb2

## Sheet Connectors.SchDoc
size A3; DocumentNumber: 11; SheetNumber: 11; SheetTotal: 11
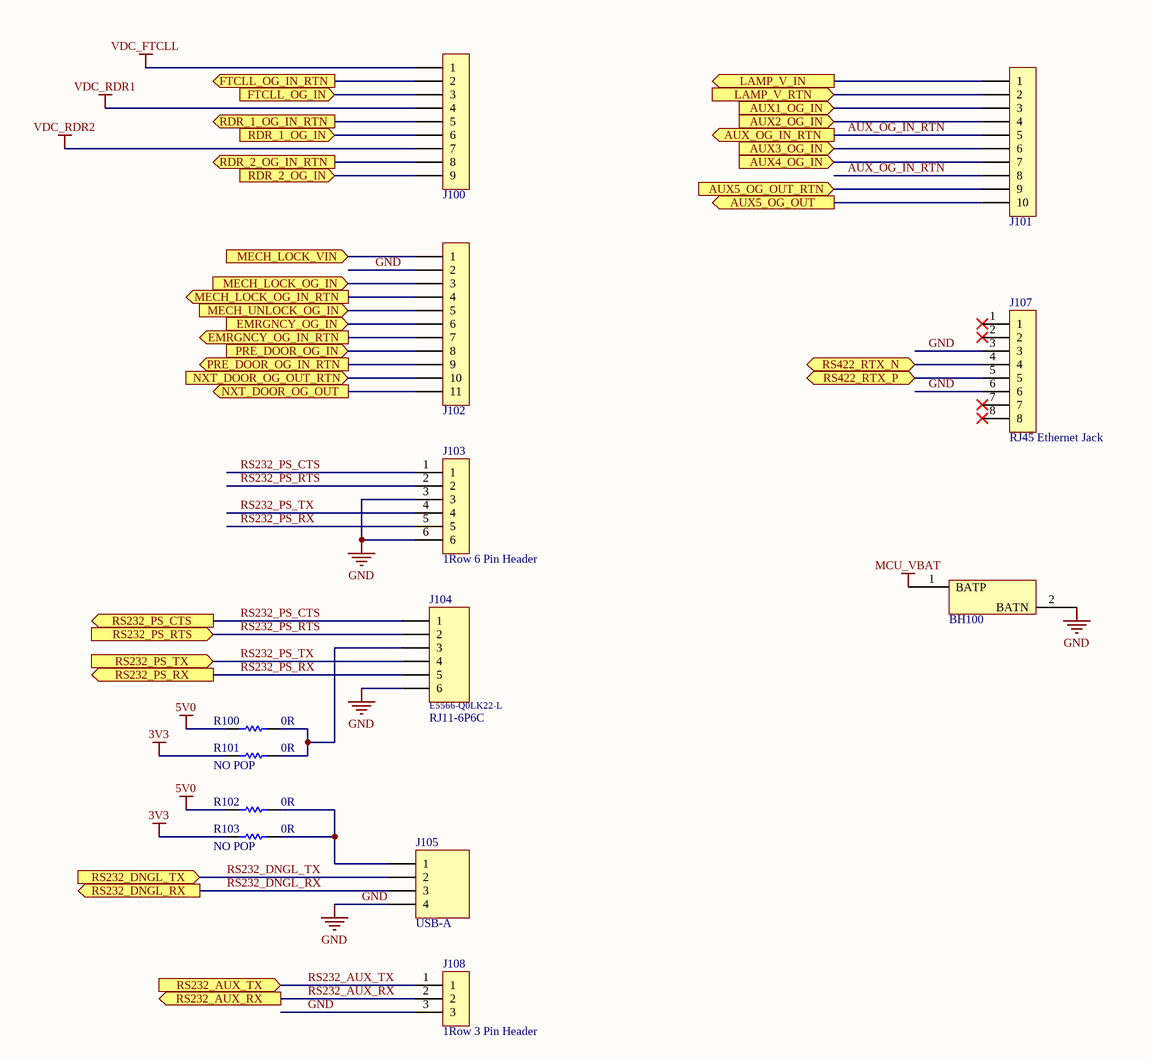
[diagram p9: Connectors.SchDoc]

### Parts
BH100  Battery Holder  [AE17-020T-2032-0101]  (value not drawn)
J100  (no value)  [AJ61-1009-TAPR-RNS0]
J101  (no value)  [AJ61-1010-TAPR-RNS0]
J102  (no value)  [AJ61-1011-TAPR-RNS0]
J103  1Row 6 Pin Header  [AJ23-1006-T8P0-VFC0]
J104  Manufacturer Part Number: E5566-Q0LK22-L  [AJ31-1006-TKSR-RPU0]  (hidden comment: RJ11-6P6C)
J105  USB-A  [AJA1-1004-TJSR-RAM0]
J107  RJ45 Ethernet Jack  [AJ32-1008-SD70-RTE0]
J108  1Row 3 Pin Header  [AJ23-1003-T8P0-VFC0]
R100  0R  [RESC1005X04N]
R101  Assembly: NO POP  [RESC1005X04N]  (hidden comment: 0R)
R102  0R  [RESC1005X04N]
R103  Assembly: NO POP  [RESC1005X04N]  (hidden comment: 0R)

### Ports
AUX1_OG_IN (in), AUX2_OG_IN (in), AUX3_OG_IN (in), AUX4_OG_IN (in), AUX5_OG_OUT (out), AUX5_OG_OUT_RTN (in), AUX_OG_IN_RTN (out), EMRGNCY_OG_IN (in), EMRGNCY_OG_IN_RTN (out), FTCLL_OG_IN (in), FTCLL_OG_IN_RTN (out), LAMP_V_IN (out), LAMP_V_RTN (in), MECH_LOCK_OG_IN (in), MECH_LOCK_OG_IN_RTN (out), MECH_LOCK_VIN (in), MECH_UNLOCK_OG_IN (in), NXT_DOOR_OG_OUT (out), NXT_DOOR_OG_OUT_RTN (in), PRE_DOOR_OG_IN (in), PRE_DOOR_OG_IN_RTN (out), RDR_1_OG_IN (in), RDR_1_OG_IN_RTN (out), RDR_2_OG_IN (in), RDR_2_OG_IN_RTN (out), RS232_AUX_RX (out), RS232_AUX_TX (in), RS232_DNGL_RX (out), RS232_DNGL_TX (in), RS232_PS_CTS (out), RS232_PS_RTS (in), RS232_PS_RX (out), RS232_PS_TX (in), RS422_RTX_N (bidir), RS422_RTX_P (bidir)

### Nets
3V3: R101.1 R103.1
5V0: R100.1 R102.1
GND: BH100.2(BATN) J102.2 J103.3 J103.6 J104.6 J105.4 J107.3 J107.6 J108.3
MCU_VBAT: BH100.1(BATP)
VDC_FTCLL: J100.1
VDC_RDR1: J100.4
VDC_RDR2: J100.7
AUX1_OG_IN: J101.3 ; port AUX1_OG_IN
AUX2_OG_IN: J101.4 ; port AUX2_OG_IN
AUX3_OG_IN: J101.6 ; port AUX3_OG_IN
AUX4_OG_IN: J101.7 ; port AUX4_OG_IN
AUX_OG_IN_RTN: J101.5 J101.8 ; port AUX_OG_IN_RTN
EMRGNCY_OG_IN: J102.6 ; port EMRGNCY_OG_IN
FTCLL_OG_IN: J100.3 ; port FTCLL_OG_IN
MECH_UNLOCK_OG_IN: J102.5 ; port MECH_UNLOCK_OG_IN
PRE_DOOR_OG_IN: J102.8 ; port PRE_DOOR_OG_IN
RDR_1_OG_IN: J100.6 ; port RDR_1_OG_IN
RDR_2_OG_IN: J100.9 ; port RDR_2_OG_IN
RS232_AUX_RX: J108.2 ; port RS232_AUX_RX  [project net RS232_4_RX]
RS232_AUX_TX: J108.1 ; port RS232_AUX_TX  [project net RS232_4_TX]
RS232_DNGL_RX: J105.3 ; port RS232_DNGL_RX  [project net RS232_3_RX]
RS232_DNGL_TX: J105.2 ; port RS232_DNGL_TX  [project net RS232_3_TX]
RS232_PS_CTS: J103.1 J104.1 ; port RS232_PS_CTS  [project net RS232_1_RX]
RS232_PS_RTS: J103.2 J104.2 ; port RS232_PS_RTS  [project net RS232_2_TX]
RS232_PS_RX: J103.5 J104.5 ; port RS232_PS_RX  [project net RS232_2_RX]
RS232_PS_TX: J103.4 J104.4 ; port RS232_PS_TX  [project net RS232_1_TX]
RS422_RTX_N: J107.4 ; port RS422_RTX_N
RS422_RTX_P: J107.5 ; port RS422_RTX_P
NetD503_3: J102.3 ; port MECH_LOCK_OG_IN
NetJ100_2: J100.2 ; port FTCLL_OG_IN_RTN
NetJ100_5: J100.5 ; port RDR_1_OG_IN_RTN
NetJ100_8: J100.8 ; port RDR_2_OG_IN_RTN
NetJ101_1: J101.1 ; port LAMP_V_IN
NetJ101_2: J101.2 ; port LAMP_V_RTN
NetJ101_9: J101.9 ; port AUX5_OG_OUT_RTN
NetJ101_10: J101.10 ; port AUX5_OG_OUT
NetJ102_1: J102.1 ; port MECH_LOCK_VIN
NetJ102_4: J102.4 ; port MECH_LOCK_OG_IN_RTN
NetJ102_7: J102.7 ; port EMRGNCY_OG_IN_RTN
NetJ102_9: J102.9 ; port PRE_DOOR_OG_IN_RTN
NetJ102_10: J102.10 ; port NXT_DOOR_OG_OUT_RTN
NetJ102_11: J102.11 ; port NXT_DOOR_OG_OUT
NetJ104_3: J104.3 R100.2 R101.2
NetJ105_1: J105.1 R102.2 R103.2

Not connected (* = marked no-connect by the designer): J107 1* 2* 7* 8*

### Notes on the sheet
- Title
- Size:
- Date:
- A3
- Number:
- Time:
- Revision:
- Sheet
- of
- File:

### Library data of the parts
BH100 = AE17-020T-2032-0101: Battery Holder, 1xCoin 20, 2032, TH, V; Manufacturer: MPD; Manufacturer Part Number: BC2032-E2; Published By: IS; Requested By: NK; CR: -; DS: -; Definition Date: 20.08.2015; Height: 5.08; Operating Temp: -40 °C to +180 °C; Footprint Type: TH; Revision: *; Revision Date: *; Lead Finish: *; Status: Active; Storage Temp: -40 °C to +180 °C; Component Type: Battery Holder; JEDEC Code: *; Package Reference: *; Price: *; Supplier: *; Supplier Part Number: *; Current Rating: -; Max. Operating Voltage: -; Value: Battery Holder
J100 = AJ61-1009-TAPR-RNS0: CON, Terminal, Klemens, 9 Pins, 1-Row, 5.08mm, TH, P, R; Manufacturer: ON-SHORE; Manufacturer Part Number: OSTOQ095451; Requested by: NK; Lead Finish: Pb Free; Max. Operating Voltage: 250VAC; Rated Current: 15A; CR: -; Definition Date: 11.08.2015; Revision Date: *; Price: *; Supplier: *; Supplier Part Number: *; DS: -; Operating Temp: -30, +105; Storage Temp: -30, +105; Status: Active; Package Reference: *; Component Type: Connector; Footprint Type: TH; Published by: NK; JEDEC Code: *; Material: *
J101 = AJ61-1010-TAPR-RNS0: CON, Terminal, Klemens, 10 Pins, 1-Row, 5.08mm, TH, P, R; Manufacturer: ON-SHORE; Manufacturer Part Number: OSTOQ105451; Requested by: NK; Lead Finish: Pb Free; Max. Operating Voltage: 250VAC; Rated Current: 15A; CR: -; Definition Date: 11.08.2015; Revision Date: *; Price: *; Supplier: *; Supplier Part Number: *; DS: -; Operating Temp: -30, +105; Storage Temp: -30, +105; Status: Active; Package Reference: *; Component Type: Connector; Footprint Type: TH; Published by: NK; JEDEC Code: *; Material: *
J102 = AJ61-1011-TAPR-RNS0: CON, Terminal, Klemens, 11 Pins, 1-Row, 5.08mm, TH, P, R; Manufacturer: ON-SHORE; Manufacturer Part Number: OSTOQ115451; Requested by: NK; Lead Finish: Pb Free; Max. Operating Voltage: 250VAC; Rated Current: 15A; CR: -; Definition Date: 11.08.2015; Revision Date: *; Price: *; Supplier: *; Supplier Part Number: *; DS: -; Operating Temp: -30, +105; Storage Temp: -30, +105; Status: Active; Package Reference: *; Component Type: Connector; Footprint Type: TH; Published by: NK; JEDEC Code: *; Material: *
J103 = AJ23-1006-T8P0-VFC0: CON, W2B, 6 Pins, 1-Row, 2.54mm, TH, P, VER; Manufacturer: FCI; Manufacturer Part Number: 68001-206HLF; CR: 000184; Requested by: NK; Lead Finish: Pb Free; Published by: MU; Definition Date: 30.01.2013; Revision Date: *; Price: *; Supplier: *; Supplier Part Number: *; DS: 000184; Operating Temp: *; Storage Temp: *; Status: Active; Package Reference: *; Component Type: Connector; Footprint Type: TH; JEDEC Code: *; Material: *; Max. Operating Voltage: *; Rated Current: *; Value: 1Row 6 Pin Header
J104 = AJ31-1006-TKSR-RPU0: CON, Jack, 6P6C, 1 Row, 6 Pins, 1.02 mm, TH, S, RA; Manufacturer: Pulse; Requested by: NK; Lead Finish: Pb Free; Max. Operating Voltage: 125V; Rated Current: 1.5A; CR: -; Definition Date: 11.08.2015; Revision Date: *; Price: *; Supplier: *; Supplier Part Number: *; DS: -; Operating Temp: -40°C to +85°C; Storage Temp: -40°C to +105°C; Status: Active; Package Reference: *; Component Type: Connector; Footprint Type: SMD; Published by: NK; JEDEC Code: *; Material: *; Value: RJ11-6P6C
J105 = AJA1-1004-TJSR-RAM0: CON, USB, 4 pins, RA, TH; Manufacturer: Amphenol Commercial; Manufacturer Part Number: UE27AC54100; Requested by: NK; Lead Finish: Pb Free; CR: *; Definition Date: 08.08.2015; Revision Date: *; Price: *; Supplier: *; Supplier Part Number: *; DS: *; Operating Temp: -55 to 155 C; Storage Temp: -55 to 155 C; Status: Active; Package Reference: -; Component Type: Connector; Footprint Type: TH; Published by: NK; JEDEC Code: *; Material: *; Max. Operating Voltage: -; Value: USB-A
J107 = AJ32-1008-SD70-RTE0: CON, Jack, 8 Pins, 1-Row, 0.61mm, SMD, S, RA; Manufacturer: TE Connectivity; Manufacturer Part Number: 5406721-2; CR: 000175; Requested by: OO; Lead Finish: Pb Free; Published by: MU; Max. Operating Voltage: 150V; Rated Current: 1.5A @25 C; Definition Date: 17.12.2012; Revision Date: *; Price: *; Supplier: *; Supplier Part Number: *; DS: 000175; Operating Temp: *; Storage Temp: *; Status: Active; Package Reference: *; Component Type: Connector; Footprint Type: SMD; JEDEC Code: *; Material: *; Value: RJ45 Ethernet Jack
J108 = AJ23-1003-T8P0-VFC0: CON, W2B, 3 Pins, 1-Row, 2.54mm, TH, P, VER; Manufacturer: FCI; Manufacturer Part Number: 68001-203HLF; CR: 000184; Requested by: NK; Lead Finish: Pb Free; Published by: MU; Definition Date: 30.01.2013; Revision Date: *; Price: *; Supplier: *; Supplier Part Number: *; DS: 000184; Operating Temp: *; Storage Temp: *; Status: Active; Package Reference: *; Component Type: Connector; Footprint Type: TH; JEDEC Code: *; Material: *; Max. Operating Voltage: *; Rated Current: *; Value: 1Row 3 Pin Header
R100-R103 = AR19-0000-S201-0000: as R327-R332 on sheet Buck_Converter; Definition Date: 09.07.2012; Revision Date: *; Price: *; Supplier: *; Supplier Part Number: *; DS: 000062; Operating Temp: -55 to 155 C; Storage Temp: -55 to 155 C; Status: Active; Package Reference: EIA 0402, Metric 1005; Component Type: Resistor; Footprint Type: SMD; JEDEC Code: *; Material: Thick Film; ESR: *; FR: *; Power Rating: 0.1W; Value: 0R